# EAGLE design UV_box_v2.2 (EAGLE 7.0.0)
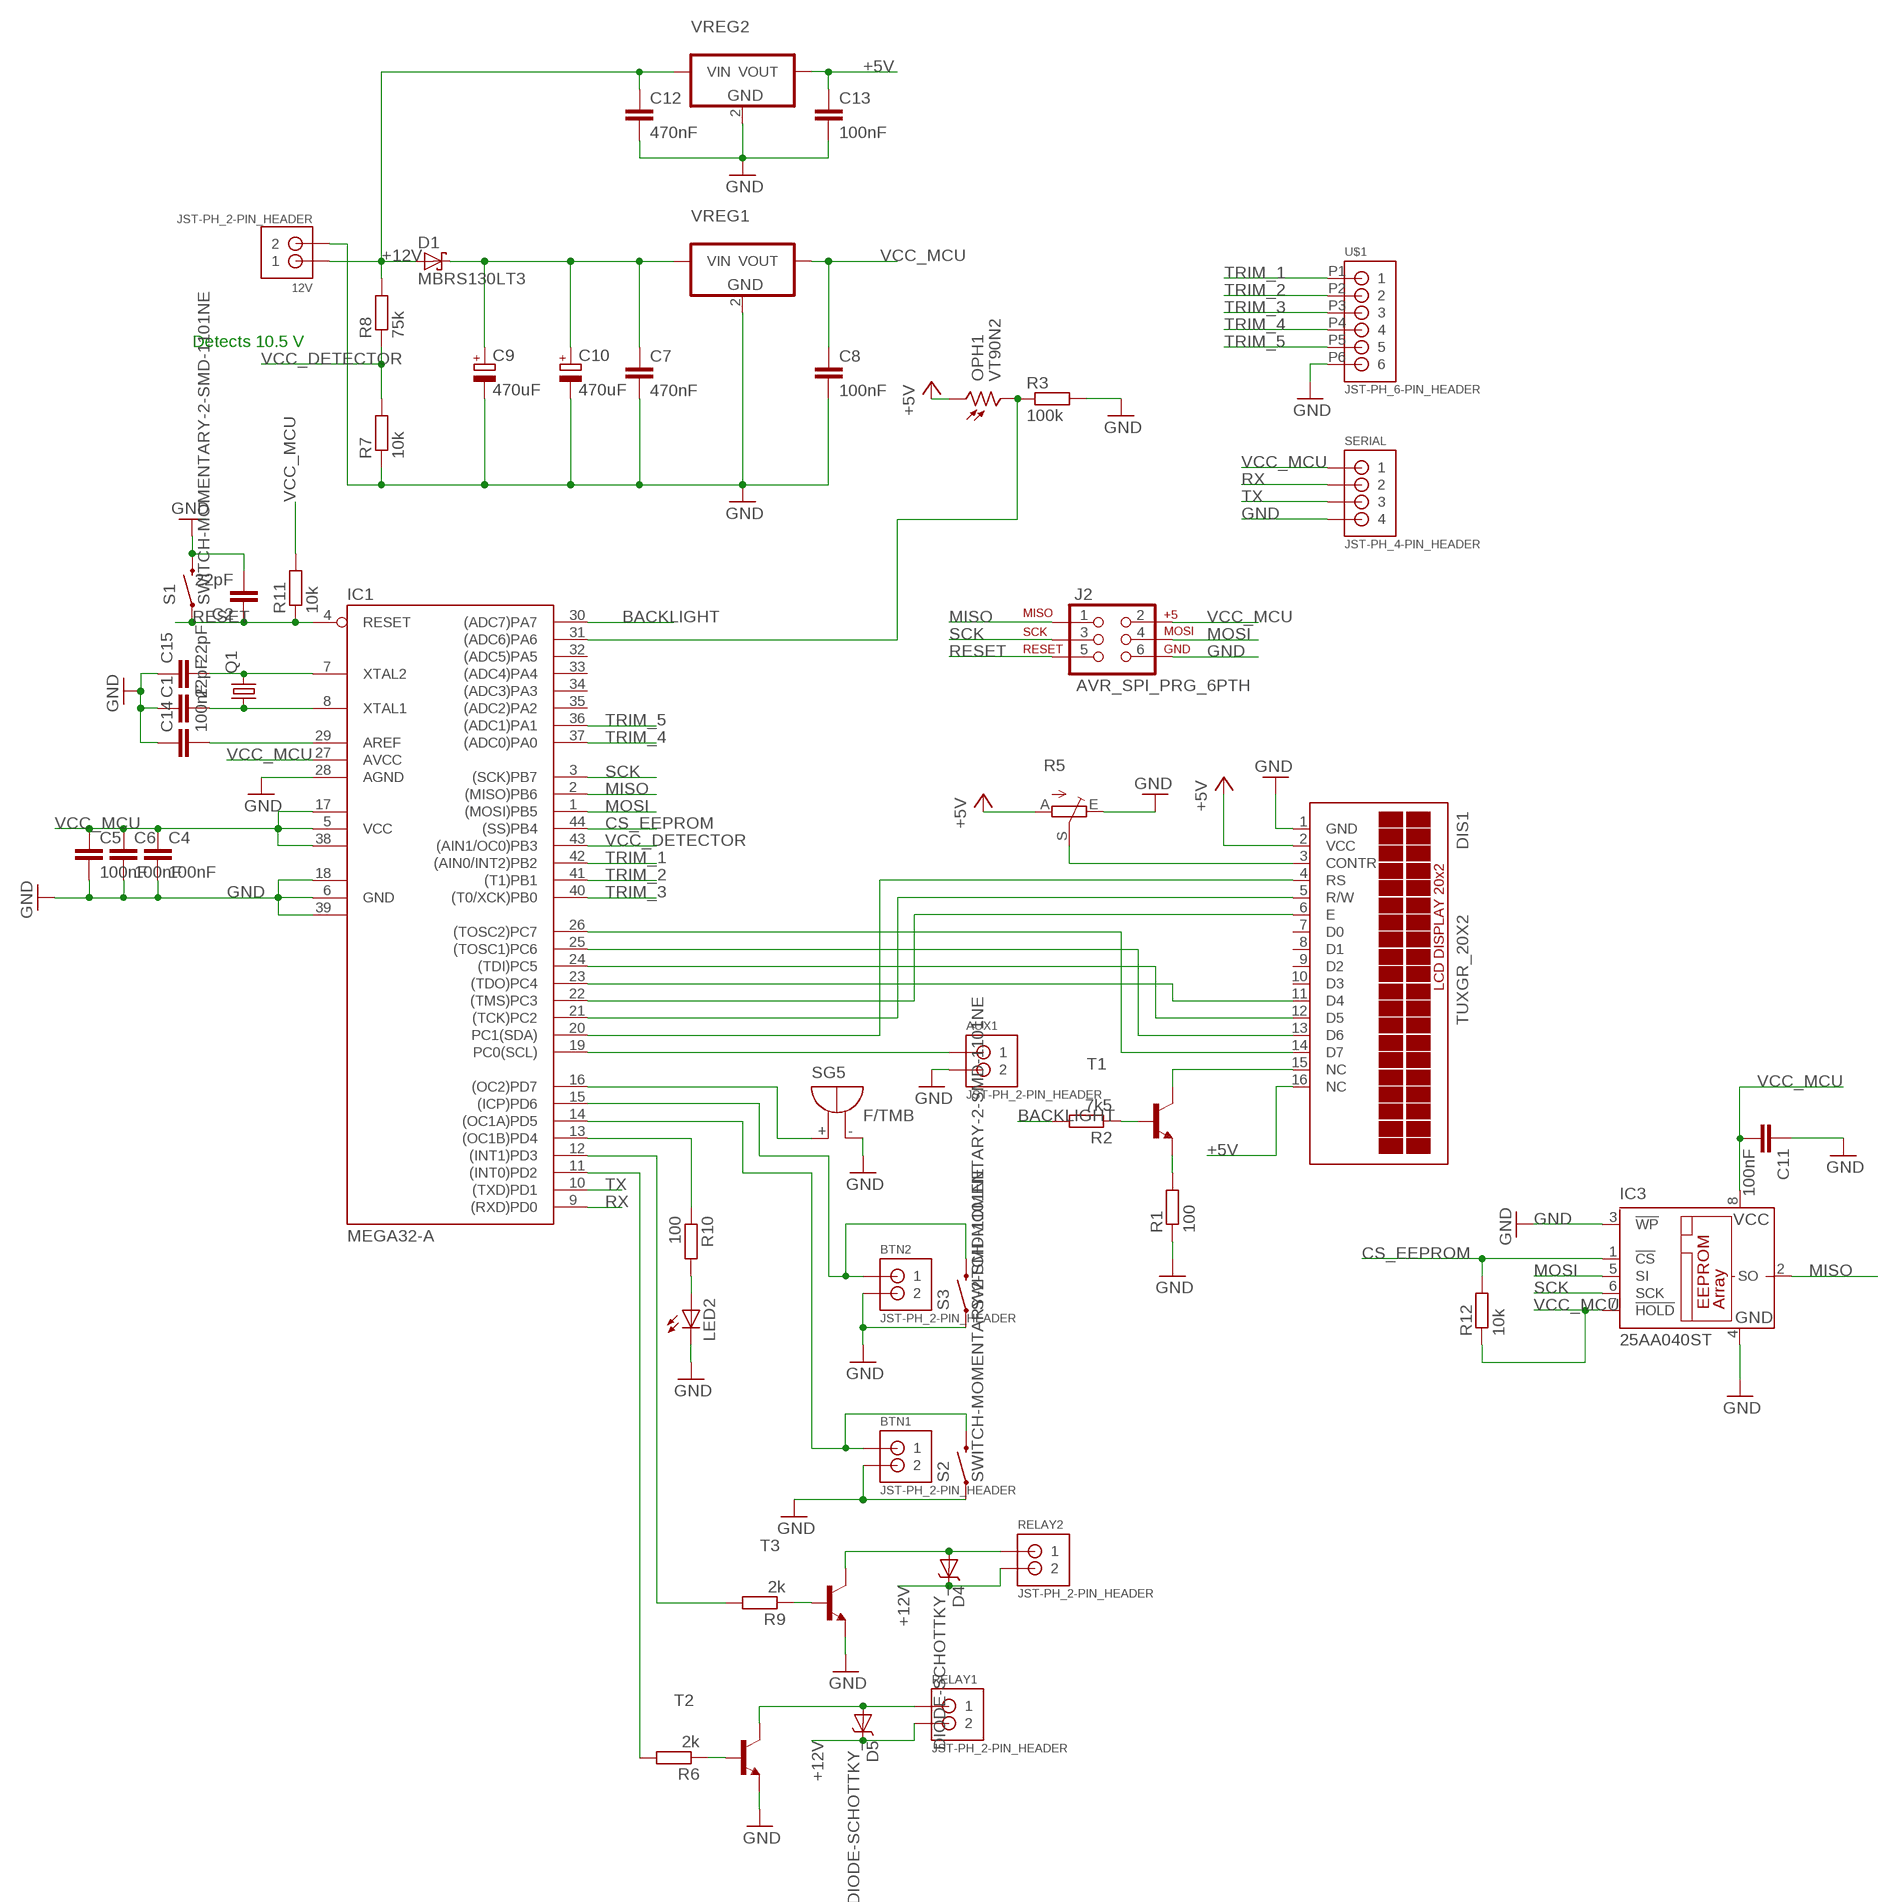
[diagram p0: schematic, sheet 1]

## Parts
12V  JST-PH_2-PIN_HEADER  [JST_B2B-PH_HEADER]
AUX1  JST-PH_2-PIN_HEADER  [JST_B2B-PH_HEADER]
BTN1  JST-PH_2-PIN_HEADER  [JST_B2B-PH_HEADER]
BTN2  JST-PH_2-PIN_HEADER  [JST_B2B-PH_HEADER]
C1  22pF  C-EUC0805  [C0805]
C2  22pF  C-EUC0805  [C0805]
C4  100nF  C-EUC0805  [C0805]
C5  100nF  C-EUC0805  [C0805]
C6  100nF  C-EUC0805  [C0805]
C7  470nF  C-EUC0805  [C0805]
C8  100nF  C-EUC0805  [C0805]
C9  470uF  CPOL-EU140CLH-0810  [140CLH-0810]
C10  470uF  CPOL-EU140CLH-0810  [140CLH-0810]
C11  100nF  C-EUC0805  [C0805]
C12  470nF  C-EUC0805  [C0805]
C13  100nF  C-EUC0805  [C0805]
C14  100nF  C-EUC0805  [C0805]
C15  22pF  C-EUC0805  [C0805]
D1  MBRS130LT3  [SMB]
D4  DIODE-SCHOTTKY_  [SMA-DIODE]
D5  DIODE-SCHOTTKY_  [SMA-DIODE]
DIS1  TUXGR_20X2  [TUXGR_20X2]
IC1  MEGA32-A  [TQFP44]
IC3  25AA040ST  [TSSOP8]
J2  AVR_SPI_PRG_6PTH  [2X3]
LED2  LEDCHIPLED_0805  [CHIPLED_0805]
OPH1  VT90N2  [VT900]
Q1  CRYSTALHC49S  [HC49/S]
R1  100  R-EU_R1206  [R1206]
R2  7k5  R-EU_R1206  [R1206]
R3  100k  R-EU_R1206  [R1206]
R5  TRIM_EU-B25P  [B25P]
R6  2k  R-EU_R1206  [R1206]
R7  10k  R-EU_R1206  [R1206]
R8  75k  R-EU_R1206  [R1206]
R9  2k  R-EU_R1206  [R1206]
R10  100  R-EU_R0805  [R0805]
R11  10k  R-EU_R1206  [R1206]
R12  10k  R-EU_R1206  [R1206]
RELAY1  JST-PH_2-PIN_HEADER  [JST_B2B-PH_HEADER]
RELAY2  JST-PH_2-PIN_HEADER  [JST_B2B-PH_HEADER]
S1  SWITCH-MOMENTARY-2-SMD-1101NE  [TACTILE-SWITCH-1101NE]
S2  SWITCH-MOMENTARY-2-SMD-1101NE  [TACTILE-SWITCH-1101NE]
S3  SWITCH-MOMENTARY-2-SMD-1101NE  [TACTILE-SWITCH-1101NE]
SERIAL  JST-PH_4-PIN_HEADER  [JST_B4B-PH_HEADER]
SG5  F/TMB  [F/TMB]
T1  BC847B-NPN-SOT23-BEC  [SOT23-BEC]
T2  BC847B-NPN-SOT23-BEC  [SOT23-BEC]
T3  BC847B-NPN-SOT23-BEC  [SOT23-BEC]
U$1  JST-PH_6-PIN_HEADER  [JST_B6B-PH_HEADER]
VREG1  VREG_3PINS-D2PAK  [D2PAK]
VREG2  VREG_3PINS-D2PAK  [D2PAK]

## Nets
+5V: C13.1 DIS1.2(VCC) DIS1.16(NC) OPH1.1 R5.A VREG2.3(VOUT)
+12V: 12V.P1 C12.1 D1.A D4.C D5.C R8.2 RELAY1.P2 RELAY2.P2 VREG2.1(VIN)
BACKLIGHT: IC1.30((ADC7)PA7) R2.2
CS_EEPROM: IC1.44((SS)PB4) IC3.1(!CS) R12.2
GND: 12V.P2 AUX1.P2 BTN1.P2 BTN2.P2 C1.1 C2.2 C4.2 C5.2 C6.2 C7.2 C8.2 C9.- C10.- C11.1 C12.2 C13.2 C14.1 C15.1 DIS1.1(GND) IC1.6(GND) IC1.18(GND1) IC1.28(AGND) IC1.39(GND2) IC3.3(!WP) IC3.4(GND) J2.6 LED2.C R1.1 R3.2 R5.E R7.1 S1.P$2 S2.P$1 S3.P$1 SERIAL.P4 SG5.- T2.E T3.E U$1.P6 VREG1.2(GND) VREG2.2(GND)
MISO: IC1.2((MISO)PB6) IC3.2(SO) J2.1
MOSI: IC1.1((MOSI)PB5) IC3.5(SI) J2.4
N$1: R1.2 T1.E
N$2: DIS1.15(NC) T1.C
N$3: DIS1.3(CONTR) R5.S
N$4: R2.1 T1.B
N$5: DIS1.4(RS) IC1.20(PC1(SDA))
N$6: DIS1.5(R/W) IC1.21((TCK)PC2)
N$7: DIS1.6(E) IC1.22((TMS)PC3)
N$8: C15.2 IC1.7(XTAL2) Q1.2
N$9: C1.2 IC1.8(XTAL1) Q1.1
N$10: IC1.16((OC2)PD7) SG5.+
N$11: DIS1.11(D4) IC1.23((TDO)PC4)
N$12: DIS1.12(D5) IC1.24((TDI)PC5)
N$13: C7.1 C9.+ C10.+ D1.C VREG1.1(VIN)
N$14: DIS1.13(D6) IC1.25((TOSC1)PC6)
N$15: DIS1.14(D7) IC1.26((TOSC2)PC7)
N$16: C14.2 IC1.29(AREF)
N$17: IC1.31((ADC6)PA6) OPH1.2 R3.1
N$18: AUX1.P1 IC1.19(PC0(SCL))
N$19: BTN2.P1 IC1.15((ICP)PD6) S3.P$2
N$20: BTN1.P1 IC1.14((OC1A)PD5) S2.P$2
N$21: IC1.11((INT0)PD2) R6.2
N$22: R6.1 T2.B
N$23: D5.A RELAY1.P1 T2.C
N$24: IC1.12((INT1)PD3) R9.2
N$25: R9.1 T3.B
N$26: D4.A RELAY2.P1 T3.C
N$27: IC1.13((OC1B)PD4) R10.1
N$28: LED2.A R10.2
RESET: C2.1 IC1.4(RESET) J2.5 R11.1 S1.P$1
RX: IC1.9((RXD)PD0) SERIAL.P2
SCK: IC1.3((SCK)PB7) IC3.6(SCK) J2.3
TRIM_1: IC1.42((AIN0/INT2)PB2) U$1.P1
TRIM_2: IC1.41((T1)PB1) U$1.P2
TRIM_3: IC1.40((T0/XCK)PB0) U$1.P3
TRIM_4: IC1.37((ADC0)PA0) U$1.P4
TRIM_5: IC1.36((ADC1)PA1) U$1.P5
TX: IC1.10((TXD)PD1) SERIAL.P3
VCC_DETECTOR: IC1.43((AIN1/OC0)PB3) R7.2 R8.1
VCC_MCU: C4.1 C5.1 C6.1 C8.1 C11.2 IC1.5(VCC) IC1.17(VCC1) IC1.27(AVCC) IC1.38(VCC2) IC3.7(!HOLD) IC3.8(VCC) J2.2 R11.2 R12.1 SERIAL.P1 VREG1.3(VOUT)
Unconnected: DIS1.7(D0) DIS1.8(D1) DIS1.9(D2) DIS1.10(D3) IC1.32((ADC5)PA5) IC1.33((ADC4)PA4) IC1.34((ADC3)PA3) IC1.35((ADC2)PA2)

## Notes on the sheet
- Detects 10.5 V

## Library data of the parts
12V AUX1 BTN1 BTN2 RELAY1 RELAY2 = SRG:JST-PH_2-PIN_HEADER: 2-pin JST PH Shrouded Header, top entry P/N B2B-PH-K-S Mating connector PHR-2 Mating cable assembly: Sparkfun PRT-09914 <http://www.sparkfun.com/products/9914>
C1 C2 C4-C8 C11-C15 = resistor:C-EU: CAPACITOR, European symbol
C9 C10 = resistor:CPOL-EU: POLARIZED CAPACITOR, European symbol
D1 = diode:MBRS130LT3: Schottky Power Rectifier Source: http://www.onsemi.com/pub/Collateral/MBRS130LT3-D.PDF
D4 D5 = SparkFun-DiscreteSemi:DIODE-SCHOTTKY: Commonly MBRA140.
DIS1 = display-lcd:TUXGR_20X2: Tuxgraphics LCD display 20x2 characters reflective, without background light Source: tuxgr_20x2.pdf; OC_FARNELL: unknown; OC_NEWARK: unknown
IC1 = avr-5:MEGA32: MICROCONTROLLER 32 Kbytes FLASH 2 Kbytes SRAM 1 Kbytes EEPROM USART 8-channel 10 bit ADC
IC3 = microchip:25*: Serial EEPROM 4K/ 8K , SPI bus; MPN: 25AA040A-I/MS; OC_FARNELL: 1331345; OC_NEWARK: 35M0801
J2 = SparkFun-Connectors:AVR_SPI_PRG_6: AVR ISP 6 Pin This is the reduced ISP connector for AVR programming. Common on Arduino. This footprint will take up less PCB space and can be used with a 10-pin to 6-pin adapter such as SKU: BOB-08508
LED2 = led:LED: LED OSRAM: - CHIPLED LG R971, LG N971, LY N971, LG Q971, LY Q971, LO R971, LY R971 LH N974, LH R974 LS Q976, LO Q976, LY Q976 LO Q996 - Hyper CHIPLED LW Q18S LB Q993, LB Q99A, LB R99A - SideLED LS A670, LO A670, LY A670, LG A670, LP A670 LB A673, LV A673, LT A673, LW A673 LH A674 LY A675 LS A676, LA A676, LO A676, LY A676, LW A676 LS A679, LY A679, LG A679 - Hyper Micro SIDELED® LS Y876, LA Y876, LO Y876, LY Y876 LT Y87S - SmartLED LW L88C, LW L88S LB L89C, LB L89S, LG L890 LS L89K, LO L89K, LY L89K LS L896, LA L896, LO L896, LY L896 - TOPLED LS T670, LO T670, LY T670, LG T670, LP T670 LSG T670, LSP T670, LSY T670, LOP T670, LYG T670 LG T671, LOG T671, LSG T671 LB T673, LV T673, LT T673, LW T673 LH T674 LS T676, LA T676, LO T676, LY T676, LB T676, LH T676, LSB T676, LW T676 LB T67C, LV T67C, LT T67C, LS T67K, LO T67K, LY T67K, LW E67C LS E67B, LA E67B, LO E67B, LY E67B, LB E67C, LV E67C, LT E67C LW T67C LS T679, LY T679, LG T679 LS T770, LO T770, LY T770, LG T770, LP T770 LB T773, LV T773, LT T773, LW T773 LH T774 LS E675, LA E675, LY E675, LS T675 LS T776, LA T776, LO T776, LY T776, LB T776 LHGB T686 LT T68C, LB T68C - Hyper Mini TOPLED® LB M676 - Mini TOPLED Santana® LG M470 LS M47K, LO M47K, LY M47K Source: http://www.osram.convergy.de LUXEON: - LUMILED® LXK2-PW12-R00, LXK2-PW12-S00, LXK2-PW14-U00, LXK2-PW14-V00 LXK2-PM12-R00, LXK2-PM12-S00, LXK2-PM14-U00 LXK2-PE12-Q00, LXK2-PE12-R00, LXK2-PE12-S00, LXK2-PE14-T00, LXK2-PE14-U00 LXK2-PB12-K00, LXK2-PB12-L00, LXK2-PB12-M00, LXK2-PB14-N00, LXK2-PB14-P00, LXK2-PB14-Q00 LXK2-PR12-L00, LXK2-PR12-M00, LXK2-PR14-Q00, LXK2-PR14-R00 LXK2-PD12-Q00, LXK2-PD12-R00, LXK2-PD12-S00 LXK2-PH12-R00, LXK2-PH12-S00 LXK2-PL12-P00, LXK2-PL12-Q00, LXK2-PL12-R00 Source: www.luxeon.com KINGBRIGHT: KA-3528ASYC Source: www.kingbright.com
OPH1 = photo-elements:VT9: Photoconductive Cell VT900 Series Source: http://optoelectronics.perkinelmer.com/content/Datasheets/DTS_vt900seriesdatasheet.pdf
Q1 = crystal:CRYSTAL: CRYSTAL; OC_FARNELL: 1667008; OC_NEWARK: unknown
R1-R3 R6-R12 = resistor:R-EU_: RESISTOR, European symbol
R5 = pot:TRIM_EU-: POTENTIOMETER
S1-S3 = SparkFun-Electromechanical:SWITCH-MOMENTARY-2: Various NO switches- pushbuttons, reed, etc
SERIAL = SRG:JST-PH_4-PIN_HEADER: 4-pin JST PH Shrouded Header, top entry P/N B4B-PH-K-S Mating connector PHR-4 Mating cable assembly: Sparkfun PRT-09916 <http://www.sparkfun.com/products/9916>
SG5 = buzzer:F/TMB: BUZZER Source: Buerklin; OC_FARNELL: unknown; OC_NEWARK: unknown
T1-T3 = transistor:*-NPN-: NPN Transistror BF959 corrected 2008.03.06
U$1 = SRG:JST-PH_6-PIN_HEADER
VREG1 VREG2 = dp_devices:VREG_3PINS: Various 3 pin voltage regulators in different packages Double check the right pinout for the right part

## Board
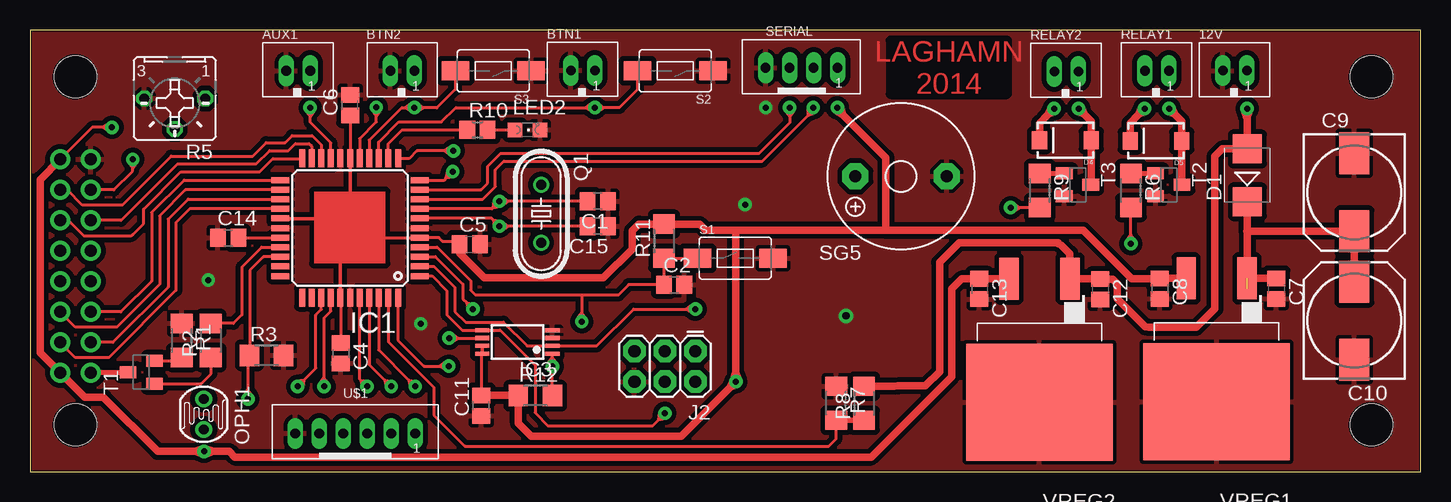
[diagram p1: board, top side]
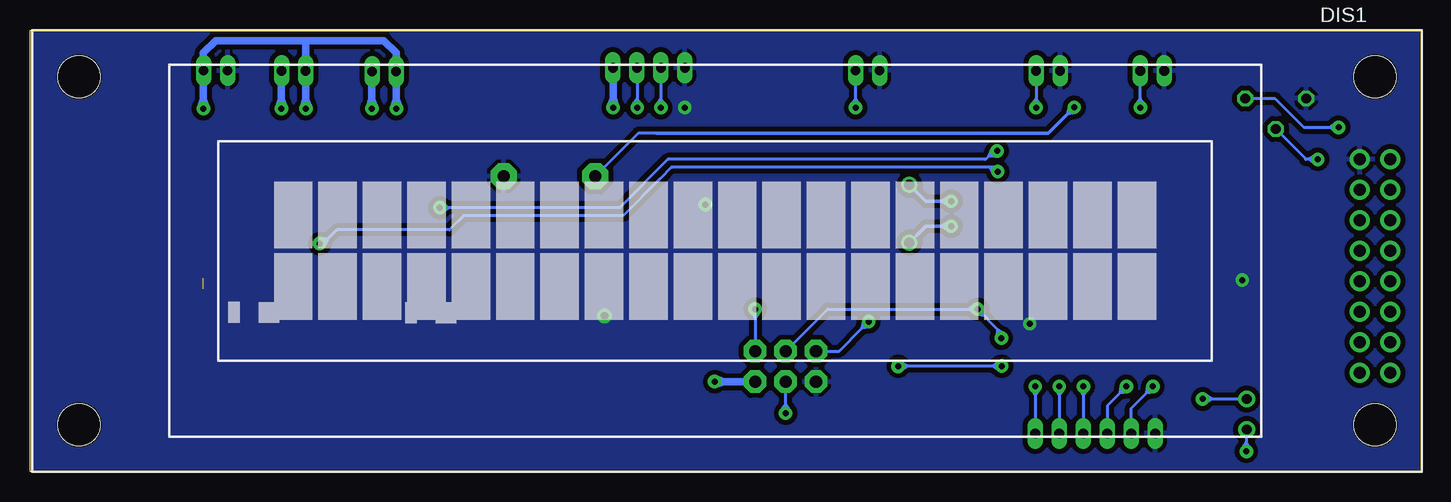
[diagram p2: board, bottom side, seen from below]

Size 115.88 x 36.82 mm. Coordinates in mm from the lower left corner, seen from the top.
Outline: 0,0 115.88,0 115.88,36.82 0,36.82 0,0
Copper layers (1*16): Top 0.035mm / dielectric 1.5mm / Bottom 0.035mm
Design rules "DesignRule": minimum track width 8mil, minimum drill 0.5mm, track to track 16mil, track to pad 12mil, pad to pad 10mil, via to via 10mil, smd to smd 8mil, copper to edge 5mil, drill to drill 8mil, minimum pad ring 10mil, minimum via ring 12mil, stop-mask expansion 4mil, vias tented up to drill 0mil, thermal gap 12mil

### Footprints (pad centres in the part's own frame; a part is rotated, then mirrored left to right if it is on the bottom)
JST_B2B-PH_HEADER = drill 0.8 long: P1 1.075,0.048; P2 -0.925,0.048
C0805 = smd 1.3 x 1.5: 1 -0.85,0; 2 0.85,0
140CLH-0810 = smd 3.5 x 2.5: + 3.25,0; - -3.25,0
SMB = smd 2.4 x 2.4: A 2.2,0; C -2.2,0
SMA-DIODE = smd 1.27 x 1.47: A -2.15,0; C 2.15,0
TUXGR_20X2 = drill 1 pad 1.676: 1 -52.73,-7.62; 2 -55.27,-7.62; 3 -52.73,-5.08; 4 -55.27,-5.08; 5 -52.73,-2.54; 6 -55.27,-2.54; 7 -52.73,0; 8 -55.27,0; 9 -52.73,2.54; 10 -55.27,2.54; 11 -52.73,5.08; 12 -55.27,5.08; 13 -52.73,7.62; 14 -55.27,7.62; 15 -52.73,10.16; 16 -55.27,10.16 | hole 3.5: -54,-14.5; 54,-14.5; -54,14.5; 54,14.5
TQFP44 = smd 1.5 x 0.5: 1 -5.8,4; 2 -5.8,3.2; 3 -5.8,2.4; 4 -5.8,1.6; 5 -5.8,0.8; 6 -5.8,0; 7 -5.8,-0.8; 8 -5.8,-1.6; 9 -5.8,-2.4; 10 -5.8,-3.2; 11 -5.8,-4; 23 5.8,-4; 24 5.8,-3.2; 25 5.8,-2.4; 26 5.8,-1.6; 27 5.8,-0.8; 28 5.8,0; 29 5.8,0.8; 30 5.8,1.6; 31 5.8,2.4; 32 5.8,3.2; 33 5.8,4 | smd 0.5 x 1.5: 12 -4,-5.8; 13 -3.2,-5.8; 14 -2.4,-5.8; 15 -1.6,-5.8; 16 -0.8,-5.8; 17 0,-5.8; 18 0.8,-5.8; 19 1.6,-5.8; 20 2.4,-5.8; 21 3.2,-5.8; 22 4,-5.8; 34 4,5.8; 35 3.2,5.8; 36 2.4,5.8; 37 1.6,5.8; 38 0.8,5.8; 39 0,5.8; 40 -0.8,5.8; 41 -1.6,5.8; 42 -2.4,5.8; 43 -3.2,5.8; 44 -4,5.8
TSSOP8 = smd 0.35 x 1.2: 1 -0.975,-2.925; 2 -0.325,-2.925; 3 0.325,-2.925; 4 0.975,-2.925; 5 0.975,2.925; 6 0.325,2.925; 7 -0.325,2.925; 8 -0.975,2.925
2X3 = drill 1.016 pad 1.88 octagon: 1 0,0; 2 0,2.54; 3 2.54,0; 4 2.54,2.54; 5 5.08,0; 6 5.08,2.54
CHIPLED_0805 = smd 1.2 x 1.2: A 0,-1.05; C 0,1.05
VT900 = drill 0.8 pad 1.4: 1 -1.27,0; 2 1.27,0
HC49/S = drill 0.813: 1 -2.413,0; 2 2.413,0
R1206 = smd 1.6 x 1.803: 1 -1.422,0; 2 1.422,0
B25P = drill 0.813 octagon: A -2.54,0; E 2.54,0; S 0,2.54
R0805 = smd 1.3 x 1.5: 1 -0.85,0; 2 0.85,0
TACTILE-SWITCH-1101NE = smd 2.3 x 1.6: P$1 -3.15,0; P$2 3.15,0
JST_B4B-PH_HEADER = drill 0.8 long: P1 2.98,0.048; P2 0.98,0.048; P3 -1.02,0.048; P4 -3.02,0.048
F/TMB = drill 1.016 pad 2.159 octagon: + 3.81,0; - -3.81,0
SOT23-BEC = smd 1 x 1.4: B -0.95,-1.1; C 0,1.1; E 0.95,-1.1
JST_B6B-PH_HEADER = drill 0.8 long: P1 5,0; P2 3,0; P3 1,0; P4 -1,0; P5 -3,0; P6 -5,0
D2PAK = smd 1.6 x 3.5: 1 -2.54,-10.28; 3 2.54,-10.28 | smd 12.2 x 9.75: 2 0,0

### Placement (x,y rotation side)
12V  100.33,33.38 0 top
AUX1  22.28,33.38 0 top
BTN1  46,33.4 0 top
BTN2  30.96,33.38 0 top
C1  47.32,22.56 180 top
C2  53.67,15.6 0 top
C4  25.88,9.88 270 top
C5  36.65,18.97 0 top
C6  26.67,30.56 90 top
C7  103.86,15.27 270 top
C8  94.16,15.27 270 top
C9  110.36,23.29 270 top
C10  110.36,12.6 90 top
C11  37.62,5.51 90 top
C12  89.18,15.21 270 top
C13  79.12,15.24 270 top
C14  16.51,19.51 0 top
C15  47.32,20.47 180 top
D1  101.45,24.71 90 top
D4  86.28,27.64 180 top
D5  93.83,27.58 180 top
DIS1  57.78,18.41 180 bottom
IC1  26.67,20.32 180 top
IC3  40.61,10.82 90 top
J2  55.45,10.06 180 top
LED2  41.45,28.5 270 top
OPH1  14.48,4.8 90 top
Q1  42.6,21.51 270 top
R1  12.65,10.95 270 top
R2  15.06,10.95 90 top
R3  19.71,9.7 0 top
R5  12.06,31.11 180 top
R6  91.74,23.44 270 top
R7  67.18,5.71 270 top
R8  69.51,5.71 90 top
R9  84.15,23.44 270 top
R10  37.29,28.5 0 top
R11  52.83,19.23 90 top
R12  42.11,6.35 0 top
RELAY1  93.83,33.38 0 top
RELAY2  86.28,33.32 0 top
S1  58.77,17.81 0 top
S2  53.77,33.43 180 top
S3  38.61,33.43 180 top
SERIAL  64.31,33.63 0 top
SG5  72.59,24.62 180 top
T1  9.27,8.31 90 top
T2  94.89,23.93 270 top
T3  87.3,23.93 270 top
U$1  27.1,3.2 0 top
VREG1  98.88,5.84 180 top
VREG2  84.12,5.82 180 top

### Tracks (layer width: path | path; a pad name or v marks a point on that pad's centre or on a via)
+5V  (via drill 0.5)
  Top 0.254: v6.83,28.7 6.08,28.7 | 6.08,28.7 5.18,28.7 DIS1.2 | 6.08,28.7 6.59,28.35 v6.83,28.7 | 6.08,28.7 6.59,29.05 v6.83,28.7
  Top 0.406: VREG2.3
  Top 0.61: DIS1.2 0.84,24.36 0.84,9.93 DIS1.16 4.55,6.22 6.12,6.22 10.64,1.7 13.75,1.7 | VREG2.3 C13.1 77.66,16.09 76.81,15.24 76.81,7.92 70.1,1.22 17.08,1.22 16.6,1.7 15.25,1.7 | v14.5,1.7 15.25,1.7 | 13.75,1.7 v14.5,1.7 | 15.25,1.7 14.59,1.94 v14.5,1.7 | 15.25,1.7 14.59,1.46 v14.5,1.7 | 13.75,1.7 14.42,1.46 v14.5,1.7 | 13.75,1.7 14.42,1.94 v14.5,1.7
  Bottom 0.254: R5.A 12.14,31.11 9.73,28.7 7.58,28.7 | 7.58,28.7 v6.83,28.7 | OPH1.1 14.5,3.53 14.5,2.45 | 14.5,2.45 v14.5,1.7 | 7.58,28.7 7.08,29.05 v6.83,28.7 | 7.58,28.7 7.08,28.35 v6.83,28.7 | 14.5,2.45 14.15,1.94 v14.5,1.7 | 14.5,2.45 14.86,1.94 v14.5,1.7
+12V  (via drill 0.5)
  Top 0.406: v101.42,30.28 v101.41,30.28 | 89.15,16.1 C12.1
  Top 0.61: v101.41,30.28 101.41,29.53 | D5.C 91.68,29.07 92.36,29.75 | 92.36,29.75 v92.89,30.28 | D4.C 84.13,29.07 84.81,29.75 | 84.81,29.75 v85.34,30.28 | 89.15,16.1 VREG2.1 86.67,18.19 85.95,18.9 85.67,19.02 85.67,19.1 77.44,19.1 75.79,17.45 75.79,8.36 74.6,7.16 72.31,7.16 72.03,7.14 R8.2 | C12.1 89.36,16.05 90.22,16.05 90.6,15.67 90.6,14.43 92.94,12.09 93.22,12.04 97.18,12.04 98.73,13.59 98.73,26.29 99.36,26.91 D1.A 101.45,29.53 101.41,29.53 | 101.41,29.53 101.66,30.19 v101.42,30.28 101.19,30.2 101.41,29.53 | 92.36,29.75 93,30.05 v92.89,30.28 | 92.36,29.75 92.66,30.39 v92.89,30.28 | 84.81,29.75 85.45,30.05 v85.34,30.28 | 84.81,29.75 85.12,30.39 v85.34,30.28
  Bottom 0.406: 12V.P1 101.42,33.43 | 92.91,33.42 RELAY1.P2 92.89,33.41 | RELAY2.P2 85.34,33.36
  Bottom 0.61: 101.42,31.03 101.42,33.43 101.42,34.92 100.41,35.94 92.91,35.94 | 101.42,31.03 v101.42,30.28 | 92.91,33.42 92.91,35.94 | RELAY2.P2 85.37,34.92 86.39,35.94 92.91,35.94 | v92.89,30.28 92.89,31.03 | 92.89,31.03 92.89,33.41 | v85.34,30.28 85.34,31.03 | 85.34,31.03 85.34,33.36 | 101.42,31.03 101.19,30.36 v101.42,30.28 | 101.42,31.03 101.66,30.36 v101.42,30.28 | 92.89,31.03 92.65,30.36 v92.89,30.28 | 92.89,31.03 93.12,30.36 v92.89,30.28 | 85.34,31.03 85.11,30.36 v85.34,30.28 | 85.34,31.03 85.58,30.36 v85.34,30.28
BACKLIGHT
  Top 0.254: 20.85,18.72 IC1.30 19.3,18.72 17.65,17.07 17.65,13.08 16.94,12.37 R2.2
CS_EEPROM  (via drill 0.5)
  Top 0.254: v43.54,8.79 43.54,9.54 | 43.54,9.54 43.54,9.83 IC3.1 | 30.66,14.5 IC1.44 30.66,14.38 30.66,10.97 32.82,8.81 34.15,8.81 | R12.2 43.53,8.04 | 43.53,8.04 v43.53,8.79 v43.54,8.79 | 34.15,8.81 v34.9,8.81 | 43.54,9.54 43.18,9.03 v43.54,8.79 | 43.54,9.54 43.89,9.03 v43.54,8.79 | 43.53,8.04 43.89,8.54 v43.54,8.79 | 43.53,8.04 43.18,8.54 v43.54,8.79 | 34.15,8.81 34.66,8.46 v34.9,8.81 | 34.15,8.81 34.66,9.16 v34.9,8.81
  Bottom 0.254: v43.54,8.79 43.51,8.81 42.79,8.81 | v34.9,8.81 35.65,8.81 | 35.65,8.81 42.79,8.81 | 42.79,8.81 43.28,8.45 v43.54,8.79 | 42.79,8.81 43.3,9.15 v43.54,8.79 | 35.65,8.81 35.14,9.16 v34.9,8.81 | 35.65,8.81 35.14,8.46 v34.9,8.81
GND  (via drill 0.5, 0.6)
  other vias: 59.59,22.28 61.32,30.35 14.86,15.98 32.56,12.34 68,13
  pour Top: 0,36.83 115.57,36.83 115.57,0 0,0
  pour Bottom: 0,36.88 115.82,36.88 115.82,0.08 -0.08,0.08 -0.08,36.68
MISO  (via drill 0.5)
  Top 0.254: IC1.2 32.49,17.12 33.66,17.12 35.41,15.37 35.41,13.36 36.3,12.47 39.45,12.47 41.42,10.49 IC3.2 47.22,10.49 50.29,13.56 54.7,13.56 | 54.7,13.56 v55.45,13.56 | 54.7,13.56 55.2,13.21 v55.45,13.56 | 54.7,13.56 55.2,13.91 v55.45,13.56
  Bottom 0.254: v55.45,13.56 55.45,12.81 | 55.45,12.81 J2.1 | 55.45,12.81 55.8,13.32 v55.45,13.56 | 55.45,12.81 55.1,13.32 v55.45,13.56
MOSI  (via drill 0.5)
  Top 0.254: IC1.1 32.49,16.33 33.5,16.33 34.75,15.09 34.75,13.08 36.02,11.81 37.67,11.81 IC3.5 37.8,11.81 37.85,11.81 37.87,11.79 37.97,11.79 38,11.81 39.17,11.81 42.09,8.89 42.09,4.93 43.2,3.81 51.84,3.81 52.38,4.35 | 52.38,4.35 v52.91,4.88 | 52.38,4.35 52.98,4.46 v52.91,4.88 | 52.38,4.35 52.49,4.95 v52.91,4.88
  Bottom 0.254: v52.91,4.88 52.91,5.63 | 52.91,5.63 J2.4 | 52.91,5.63 52.56,5.12 v52.91,4.88 | 52.91,5.63 53.26,5.12 v52.91,4.88
N$1
  Top 0.254: T1.E 12.65,9.26 R1.2
  Top 0.406: 12.57,9.26 R1.2
N$2
  Top 0.406: T1.C 5.05,8.31 DIS1.15 | DIS1.15
N$3  (via drill 0.5)
  Top 0.254: DIS1.3 6.99,23.5 8.56,25.07 8.56,25.29 | 8.56,25.29 v8.56,26.04 | 8.56,25.29 8.91,25.79 v8.56,26.04 | 8.56,25.29 8.21,25.79 v8.56,26.04
  Bottom 0.254: R5.S 9.56,26.07 | 9.56,26.07 9.53,26.04 | v8.56,26.04 9.31,26.04 | 9.31,26.04 9.56,26.04 9.56,26.07 | 9.31,26.04 8.8,26.39 v8.56,26.04 | 9.31,26.04 8.8,25.68 v8.56,26.04
N$4
  Top 0.254: T1.B 14.27,7.36 15.09,8.18 15.09,9.5 R2.1
N$5
  Top 0.254: 24.28,26.14 IC1.20 24.27,27.27 23.52,28.02 21.84,28.02 21.26,27.43 19.68,27.43 18.57,26.31 11.76,26.31 7.67,22.23 4.37,22.23 3.1,23.5 DIS1.4
N$6
  Top 0.254: IC1.21 23.47,26.14 23.47,27.13 23.24,27.36 22.12,27.36 21.54,26.77 19.96,26.77 18.85,25.65 12.29,25.65 7.59,20.95 DIS1.5
N$7
  Top 0.254: DIS1.6 3.2,20.95 4.47,19.68 8.46,19.68 8.56,19.76 9.47,20.68 9.47,21.89 12.57,24.99 19.13,24.99 20.24,26.11 IC1.22
N$8  (via drill 0.5)
  Top 0.254: v39.12,20.47 38.59,21 | 38.59,21 38.47,21.12 IC1.7 | C15.2 39.87,20.47 | 39.87,20.47 v39.12,20.47 | 38.59,21 38.7,20.4 v39.12,20.47 | 38.59,21 39.19,20.89 v39.12,20.47 | 39.87,20.47 39.36,20.82 v39.12,20.47 | 39.87,20.47 39.36,20.12 v39.12,20.47
  Bottom 0.305: Q1.2 41.22,20.47 39.87,20.47 | 39.87,20.47 v39.12,20.47 | 39.87,20.47 39.33,20.81 v39.12,20.47 | 39.87,20.47 39.33,20.13 v39.12,20.47
N$9  (via drill 0.5)
  Top 0.254: v39.12,22.55 38.59,22.02 | 38.59,22.02 38.48,21.92 IC1.8 | C1.2 39.87,22.55 | 39.87,22.55 v39.12,22.55 | 38.59,22.02 39.19,22.13 v39.12,22.55 | 38.59,22.02 38.7,22.63 v39.12,22.55 | 39.87,22.55 39.36,22.91 v39.12,22.55 | 39.87,22.55 39.36,22.2 v39.12,22.55
  Bottom 0.305: Q1.1 41.22,22.55 39.87,22.55 | 39.87,22.55 v39.12,22.55 | 39.87,22.55 39.33,22.89 v39.12,22.55 | 39.87,22.55 39.33,22.22 v39.12,22.55
N$10  (via drill 0.5)
  Top 0.254: 27.46,26.14 IC1.16 27.47,27.77 28.85,29.16 28.85,29.63 | 28.85,29.63 v28.85,30.38 | 28.85,29.63 29.21,30.13 v28.85,30.38 | 28.85,29.63 28.5,30.13 v28.85,30.38
  Bottom 0.254: 63.63,28.22 65.18,28.22 SG5.+
  Bottom 0.305: 29.39,29.85 31.01,28.22 63.63,28.22 | 29.39,29.85 v28.85,30.38 | 29.39,29.85 29.25,30.47 v28.85,30.38 | 29.39,29.85 28.77,29.99 v28.85,30.38
N$11
  Top 0.254: 20.85,24.31 IC1.23 12.84,24.32 10.13,21.61 10.13,15.9 7.57,13.34 DIS1.11
N$12
  Top 0.254: DIS1.12 3.79,12.06 7.24,12.06 10.79,15.62 10.79,21.34 12.95,23.5 20.83,23.5 IC1.24
N$13  (1 unrouted)
  Top 0.406: 101.41,16.14 VREG1.1
  Top 0.61: 101.41,16.14 103.96,16.14 C7.1 | 101.45,20.04 C9.+ C10.+ | 101.41,20.04 101.42,20.04 | 101.45,20.04 D1.C | 101.45,20.04 101.42,20.04 | 101.42,20.04 101.42,15.27
N$14
  Top 0.254: 20.85,22.71 IC1.25 13.17,22.72 11.51,21.06 11.51,15.39 6.91,10.79 DIS1.13
N$15
  Top 0.254: IC1.26 13.31,21.92 12.17,20.78 12.17,15.11 6.58,9.53 3.79,9.53 DIS1.14
N$16
  Top 0.254: C14.2 20.87,19.51 IC1.29
N$17  (via drill 0.5)
  Top 0.254: IC1.31 19.44,17.92 18.31,16.79 18.31,9.73 R3.1 18.16,9.7 18.16,6.82 | 18.16,6.82 v18.16,6.07 | 18.16,6.82 17.81,6.32 v18.16,6.07 | 18.16,6.82 18.51,6.32 v18.16,6.07
  Bottom 0.254: v18.16,6.07 17.41,6.07 | 17.41,6.07 OPH1.2 | 17.41,6.07 17.92,5.72 v18.16,6.07 | 17.41,6.07 17.92,6.42 v18.16,6.07
N$18  (via drill 0.5)
  Top 0.254: IC1.19 25.07,26.14 25.07,27.41 23.34,29.13 23.34,29.6 | 23.34,29.6 v23.34,30.35 | 23.34,29.6 23.69,30.11 v23.34,30.35 | 23.34,29.6 22.99,30.11 v23.34,30.35
  Bottom 0.254: v23.34,30.35 23.35,30 23.35,31.1 | 23.35,31.1 AUX1.P1 | 23.35,31.1 22.99,30.6 v23.34,30.35 | 23.35,31.1 23.7,30.59 v23.34,30.35
N$19  (via drill 0.5)
  Top 0.254: 28.27,26.14 IC1.15 | S3.P$2 35.46,31.88 33.91,30.33 32.78,30.33 | 32.78,30.33 32.05,30.33 v32.03,30.35 | 28.27,26.26 IC1.15 | 31.28,30.35 30.99,30.35 28.27,27.64 IC1.15 | 31.28,30.35 v32.03,30.35 | 32.78,30.33 32.28,30.7 v32.03,30.35 | 32.78,30.33 32.26,29.99 v32.03,30.35 | 31.28,30.35 31.79,30 v32.03,30.35 | 31.28,30.35 31.79,30.7 v32.03,30.35
  Bottom 0.254: BTN2.P1 32.03,31.1 | 32.03,31.1 v32.03,30.35 | 32.03,31.1 31.68,30.6 v32.03,30.35 | 32.03,31.1 32.38,30.6 v32.03,30.35
N$20  (via drill 0.5)
  Top 0.254: 29.06,26.14 IC1.14 | S2.P$2 50.62,31.85 49.12,30.35 47.82,30.35 | 47.82,30.35 v47.07,30.35 | 29.06,26.26 IC1.14 | IC1.14 29.06,26.39 29.06,27.48 30.73,29.16 34.29,29.16 35.48,30.35 46.32,30.35 | 46.32,30.35 v47.07,30.35 | 47.82,30.35 47.32,30.7 v47.07,30.35 | 47.82,30.35 47.32,30 v47.07,30.35 | 46.32,30.35 46.83,30 v47.07,30.35 | 46.32,30.35 46.83,30.7 v47.07,30.35
  Bottom 0.254: v47.07,30.35 47.07,31.1 | 47.07,31.1 BTN1.P1 | 47.07,31.1 46.72,30.6 v47.07,30.35 | 47.07,31.1 47.43,30.6 v47.07,30.35
N$21  (via drill 0.5)
  Top 0.254: IC1.11 34.53,24.32 34.7,24.49 | 34.7,24.49 v35.23,25.02 | v91.75,19.02 91.75,19.77 | 91.75,19.77 R6.2 | 34.7,24.49 35.31,24.6 v35.23,25.02 | 34.7,24.49 34.81,25.09 v35.23,25.02 | 91.75,19.77 91.39,19.27 v91.75,19.02 | 91.75,19.77 92.1,19.27 v91.75,19.02
  Bottom 0.254: 91.75,19 v91.75,19.02 | v35.23,25.02 35.38,25.17 | v35.23,25.02 35.46,25.27 35.56,25.38 35.89,25.38 | 35.89,25.38 62.43,25.38 63.37,24.43 63.45,24.33 63.48,24.33 66.45,21.36 79.73,21.36 80.92,20.17 90.25,20.17 90.27,20.14 90.35,20.14 91.09,19.4 | 91.09,19.4 91.36,19.13 91.67,19.13 v91.75,19.02 | 35.89,25.38 35.28,25.44 v35.23,25.02 | 35.89,25.38 35.61,24.82 v35.23,25.02 | 91.09,19.4 91.36,18.84 v91.75,19.02 | 91.09,19.4 91.71,19.45 v91.75,19.02
N$22
  Top 0.406: R6.1 93.79,24.87 T2.B
N$23  (via drill 0.5)
  Top 0.406: D5.A
  Top 0.61: D5.A 95.98,29.22 95.45,29.75 | 95.45,29.75 v94.92,30.28 | T2.C D5.A | 95.45,29.75 95.14,30.39 v94.92,30.28 | 95.45,29.75 94.81,30.05 v94.92,30.28
  Bottom 0.254: 94.92,33.41 RELAY1.P1
  Bottom 0.61: v94.92,30.28 94.92,31.03 | 94.92,31.03 94.92,33.41 | 94.92,31.03 94.68,30.36 v94.92,30.28 | 94.92,31.03 95.16,30.36 v94.92,30.28
N$24  (via drill 0.5)
  Top 0.254: R9.2 82.46,22.02 | 82.46,22.02 v81.71,22.02 | v81.71,22.02 | v35.28,26.75 34.53,26.75 | 34.53,26.75 32.23,26.75 31.6,26.11 IC1.12 | 82.46,22.02 81.96,22.37 v81.71,22.02 | 82.46,22.02 81.96,21.67 v81.71,22.02 | 34.53,26.75 35.04,26.39 v35.28,26.75 | 34.53,26.75 35.04,27.1 v35.28,26.75
  Bottom 0.254: 35.92,26.36 35.53,26.75 v35.28,26.75 | 35.92,26.36 36.25,26.04 62.71,26.04 66.73,22.02 80.96,22.02 | 80.96,22.02 v81.71,22.02 | 80.96,22.02 81.47,21.67 v81.71,22.02 | 80.96,22.02 81.47,22.37 v81.71,22.02 | 35.92,26.36 35.67,26.92 v35.28,26.75 | 35.92,26.36 35.31,26.32 v35.28,26.75
N$25
  Top 0.406: R9.1 86.2,24.87 T3.B
N$26  (via drill 0.5)
  Top 0.406: 88.43,24.25 T3.C
  Top 0.61: 87.91,29.75 88.43,29.22 D4.A 88.43,24.25 | 87.91,29.75 v87.38,30.28 | 87.91,29.75 87.6,30.39 v87.38,30.28 | 87.91,29.75 87.27,30.05 v87.38,30.28
  Bottom 0.406: 87.38,33.35 RELAY2.P1
  Bottom 0.61: v87.38,30.28 87.38,31.03 | 87.38,31.03 87.38,33.35 | 87.38,31.03 87.14,30.36 v87.38,30.28 | 87.38,31.03 87.61,30.36 v87.38,30.28
N$27
  Top 0.254: IC1.13 29.87,26.14 29.87,27.36 31.01,28.5 R10.1
N$28
  Top 0.254: R10.2 LED2.A
N$29
  pour Bottom: -0.1,-0.1 115.8,-0.1 115.8,36.9 -0.1,36.9 -0.1,0
N$30
  pour Top: 0,0 115.8,0 115.8,36.9 0,36.9
RESET  (via drill 0.5)
  Top 0.254: 32.49,18.72 IC1.4 32.61,18.72 33.93,18.72 36.73,15.93 36.73,15.14 37.11,14.76 45.97,14.76 | 45.97,14.76 45.97,13.27 | 45.97,13.27 v45.97,12.52 | 45.97,13.27 45.62,12.77 v45.97,12.52 | 45.97,13.27 46.33,12.77 v45.97,12.52 | 45.97,14.76 49.05,14.76 49.89,15.6 C2.1 52.83,15.61 R11.1 S1.P$1
  Bottom 0.254: J2.5 48.44,10.06 46.5,11.99 | 46.5,11.99 v45.97,12.52 | 46.5,11.99 46.4,12.6 v45.97,12.52 | 46.5,11.99 45.9,12.1 v45.97,12.52
RX  (via drill 0.5)
  Top 0.254: IC1.9 32.49,22.71 37.72,22.71 38.79,23.77 38.79,25.17 39.5,25.88 61.04,25.88 64.87,29.72 | v65.28,30.35 65.28,30.12 64.87,29.72 | 64.87,29.72 65.44,29.96 v65.28,30.35 | 64.87,29.72 64.85,30.34 v65.28,30.35
  Bottom 0.254: SERIAL.P2 65.28,33.68 65.28,31.1 | 65.28,31.1 v65.28,30.35 | 65.28,31.1 64.93,30.6 v65.28,30.35 | 65.28,31.1 65.63,30.6 v65.28,30.35
SCK  (via drill 0.5)
  Top 0.254: IC1.3 32.49,17.93 33.78,17.93 36.07,15.65 36.07,14.4 36.38,14.09 | v34.92,11.15 v34.93,11.14 35.67,11.14 | 35.67,11.14 IC3.6 | 36.38,14.09 v36.91,13.56 | 36.38,14.09 36.48,13.49 v36.91,13.56 | 36.38,14.09 36.98,13.98 v36.91,13.56 | 35.67,11.14 35.17,11.5 v34.92,11.15 | 35.67,11.14 35.17,10.8 v34.92,11.15
  Bottom 0.254: v36.91,13.56 35.24,11.83 | 35.24,11.83 34.92,11.51 v34.92,11.15 | J2.3 49.4,13.56 37.66,13.56 | 37.66,13.56 v36.91,13.56 | v36.91,13.56 36.99,13.14 36.39,13.02 36.48,13.63 v36.91,13.56 | 37.66,13.56 37.15,13.91 v36.91,13.56 | 37.66,13.56 37.15,13.21 v36.91,13.56 | 35.24,11.83 34.71,11.52 v34.92,11.15 | 35.24,11.83 35.35,11.22 v34.92,11.15
TRIM_1  (via drill 0.5)
  Top 0.254: 31.57,7.64 29.06,10.16 29.06,14.5 IC1.42 | 31.57,7.64 v32.11,7.11 | 31.57,7.64 31.68,7.04 v32.11,7.11 | 31.57,7.64 32.18,7.53 v32.11,7.11
  Bottom 0.254: v32.11,7.11 v32.1,7.11 32.1,6.36 | 32.1,6.36 U$1.P1 | 32.1,6.36 32.46,6.87 v32.11,7.11 | 32.1,6.36 31.75,6.87 v32.11,7.11
TRIM_2  (via drill 0.5)
  Top 0.254: IC1.41 28.27,14.5 28.27,8.94 29.57,7.64 | 29.57,7.64 v30.1,7.11 | 29.57,7.64 29.68,7.04 v30.1,7.11 | 29.57,7.64 30.18,7.53 v30.1,7.11
  Bottom 0.254: v30.1,7.11 30.1,6.36 | 30.1,6.36 U$1.P2 | 30.1,6.36 30.45,6.87 v30.1,7.11 | 30.1,6.36 29.75,6.87 v30.1,7.11
TRIM_3  (via drill 0.5)
  Top 0.254: 27.48,14.52 IC1.40 27.46,14.4 27.46,7.75 27.56,7.64 | 27.56,7.64 v28.09,7.11 | 27.56,7.64 27.67,7.04 v28.09,7.11 | 27.56,7.64 28.17,7.53 v28.09,7.11
  Bottom 0.254: v28.09,7.11 28.1,7.11 28.1,6.36 | 28.1,6.36 U$1.P3 | 28.1,6.36 28.45,6.87 v28.09,7.11 | 28.1,6.36 27.74,6.86 v28.09,7.11
TRIM_4  (via drill 0.5)
  Top 0.254: v24.51,7.11 24.49,7.14 24.49,7.86 | 24.49,7.86 24.49,12.8 25.07,13.39 IC1.37 25.07,14.5 | 24.49,7.86 24.15,7.34 v24.51,7.11 | 24.49,7.86 24.85,7.37 v24.51,7.11
  Bottom 0.254: v24.51,7.11 25.04,6.58 | 25.04,6.58 26.1,5.52 U$1.P4 | 25.04,6.58 24.93,7.19 v24.51,7.11 | 25.04,6.58 24.43,6.69 v24.51,7.11
TRIM_5  (via drill 0.5)
  Top 0.254: IC1.36 24.28,14.5 24.28,13.54 23.82,13.08 23.82,8.64 22.83,7.64 | v22.3,7.11 22.83,7.64 | 22.83,7.64 22.23,7.53 v22.3,7.11 | 22.83,7.64 22.72,7.04 v22.3,7.11
  Bottom 0.254: U$1.P5 24.1,5.31 22.83,6.58 | 22.83,6.58 v22.3,7.11 | 22.83,6.58 22.72,7.19 v22.3,7.11 | 22.83,6.58 22.23,6.69 v22.3,7.11
TX  (via drill 0.5)
  Top 0.254: IC1.10 32.49,23.52 37.59,23.52 38.12,24.05 38.12,25.45 39.22,26.54 60.76,26.54 63.3,29.08 63.3,29.6 | v63.3,30.35 63.3,29.6 | 63.3,29.6 63.65,30.11 v63.3,30.35 | 63.3,29.6 62.95,30.11 v63.3,30.35
  Bottom 0.254: SERIAL.P3 63.3,31.1 | 63.3,31.1 v63.3,30.35 | 63.3,31.1 62.95,30.6 v63.3,30.35 | 63.3,31.1 63.65,30.6 v63.3,30.35
VCC_DETECTOR
  Top 0.254: IC1.43 29.87,10.82 33.66,7.04 33.66,4.72 36.25,2.13 66.57,2.13 67.18,2.74 R7.2
  Top 0.457: R7.2 R8.1
VCC_MCU  (via drill 0.5)
  Top 0.254: 25.88,14.52 IC1.38 25.88,14.4 C4.1 | IC3.8 IC3.7 37.69,9.8 37.62,9.73 C11.2 | 40.68,6.36 R12.1 | 26.67,20.45 27.6,19.52 IC1.5 | 32.59,19.53 IC1.5 | 32.72,19.53 IC1.5 | IC1.5 34.07,19.52 34.37,19.23 35.8,19.23 C5.1 | C6.1 IC1.17
  Top 0.305: IC1.38 25.87,19.65 | 25.87,19.65 24.41,21.11 20.88,21.11 IC1.27 | IC1.17 26.67,20.45 25.87,19.65
  Top 0.406: VREG1.3
  Top 0.61: VREG1.3 C8.1 93.98,16.1 91.8,16.1 87.78,20.12 71.32,20.12 | C11.2 40.68,6.36 | v67.28,30.35 67.31,30.35 | 67.75,29.76 71.32,26.19 71.32,20.12 | 67.75,29.76 67.28,30.23 v67.28,30.35 | v58.83,7.52 58.83,8.27 | 58.83,8.27 58.83,20.12 | v58.83,7.52 58.3,6.99 | 58.3,6.99 54.28,2.97 41.76,2.97 40.69,4.04 R12.1 | R12.1 | C5.1 35.8,18.2 37.85,16.15 47.78,16.15 50.19,18.57 50.19,20.09 50.75,20.65 R11.2 | 67.75,29.76 67.52,30.43 v67.28,30.35 | 67.75,29.76 67.15,30.14 v67.28,30.35 | 58.83,8.27 58.59,7.6 v58.83,7.52 | 58.83,8.27 59.06,7.6 v58.83,7.52 | 58.3,6.99 58.93,7.29 v58.83,7.52 | 58.3,6.99 58.6,7.63 v58.83,7.52 | R11.2 52.86,20.62 55.8,20.62 56.31,20.12 58.83,20.12 | 71.32,20.12 58.83,20.12 | R11.2
  Bottom 0.61: SERIAL.P1 67.28,31.1 | 67.28,31.1 v67.28,30.35 | v58.83,7.52 58.08,7.52 | 58.08,7.52 J2.2 | 67.28,31.1 67.05,30.44 v67.28,30.35 | 67.28,31.1 67.52,30.44 v67.28,30.35 | 58.08,7.52 58.74,7.28 v58.83,7.52 | 58.08,7.52 58.74,7.75 v58.83,7.52
(copper drawn outside any net)
  shapes: Top area x1

### Text on the board
Top: LAGHAMN / 2014